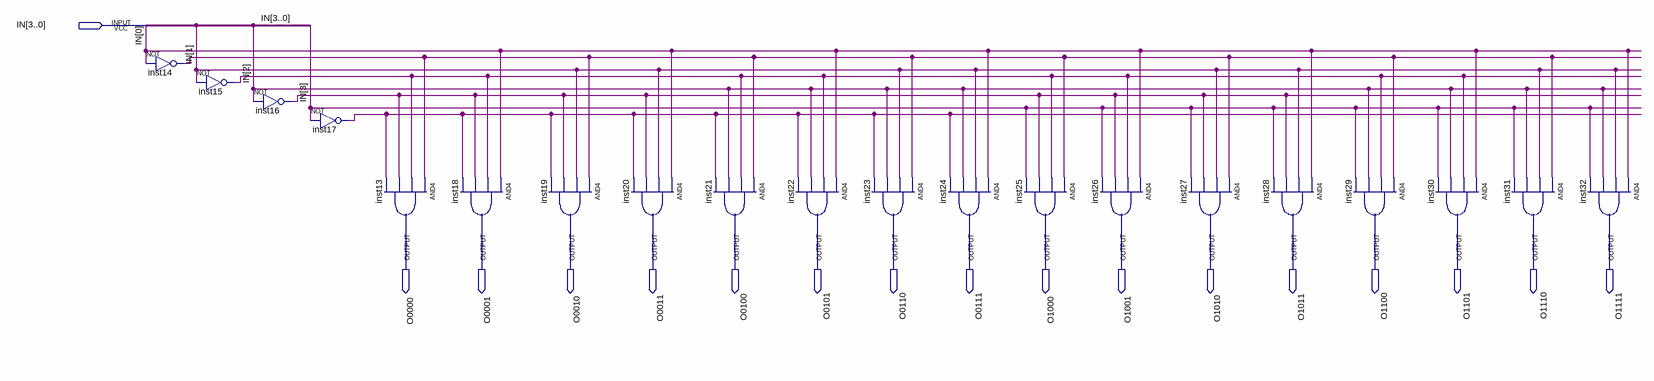
[diagram p0: schematic sheet]
// Quartus schematic opSelector.bdf as structural Verilog: 20 symbols, 17 pins
module opSelector (
  input  [3:0] IN,
  output O0000,
  output O0001,
  output O0010,
  output O0011,
  output O0100,
  output O0101,
  output O0110,
  output O0111,
  output O1000,
  output O1001,
  output O1010,
  output O1011,
  output O1100,
  output O1101,
  output O1110,
  output O1111
);

  wire inst14_out, inst15_out, inst16_out, inst17_out;

  not inst14 (inst14_out, IN[0]);
  not inst15 (inst15_out, IN[1]);
  not inst16 (inst16_out, IN[2]);
  not inst17 (inst17_out, IN[3]);
  and inst13 (O0000, inst14_out, inst15_out, inst16_out, inst17_out);
  and inst18 (O0001, IN[0], inst15_out, inst16_out, inst17_out);
  and inst19 (O0010, inst14_out, IN[1], inst16_out, inst17_out);
  and inst20 (O0011, IN[0], IN[1], inst16_out, inst17_out);
  and inst21 (O0100, inst14_out, inst15_out, IN[2], inst17_out);
  and inst22 (O0101, IN[0], inst15_out, IN[2], inst17_out);
  and inst23 (O0110, inst14_out, IN[1], IN[2], inst17_out);
  and inst24 (O0111, IN[0], IN[1], IN[2], inst17_out);
  and inst25 (O1000, inst14_out, inst15_out, inst16_out, IN[3]);
  and inst26 (O1001, IN[0], inst15_out, inst16_out, IN[3]);
  and inst27 (O1010, inst14_out, IN[1], inst16_out, IN[3]);
  and inst28 (O1011, IN[0], IN[1], inst16_out, IN[3]);
  and inst29 (O1100, inst14_out, inst15_out, IN[2], IN[3]);
  and inst30 (O1101, IN[0], inst15_out, IN[2], IN[3]);
  and inst31 (O1110, inst14_out, IN[1], IN[2], IN[3]);
  and inst32 (O1111, IN[0], IN[1], IN[2], IN[3]);
endmodule
